# EAGLE schematic Sparkle_and_Shine (EAGLE 9.4.2)
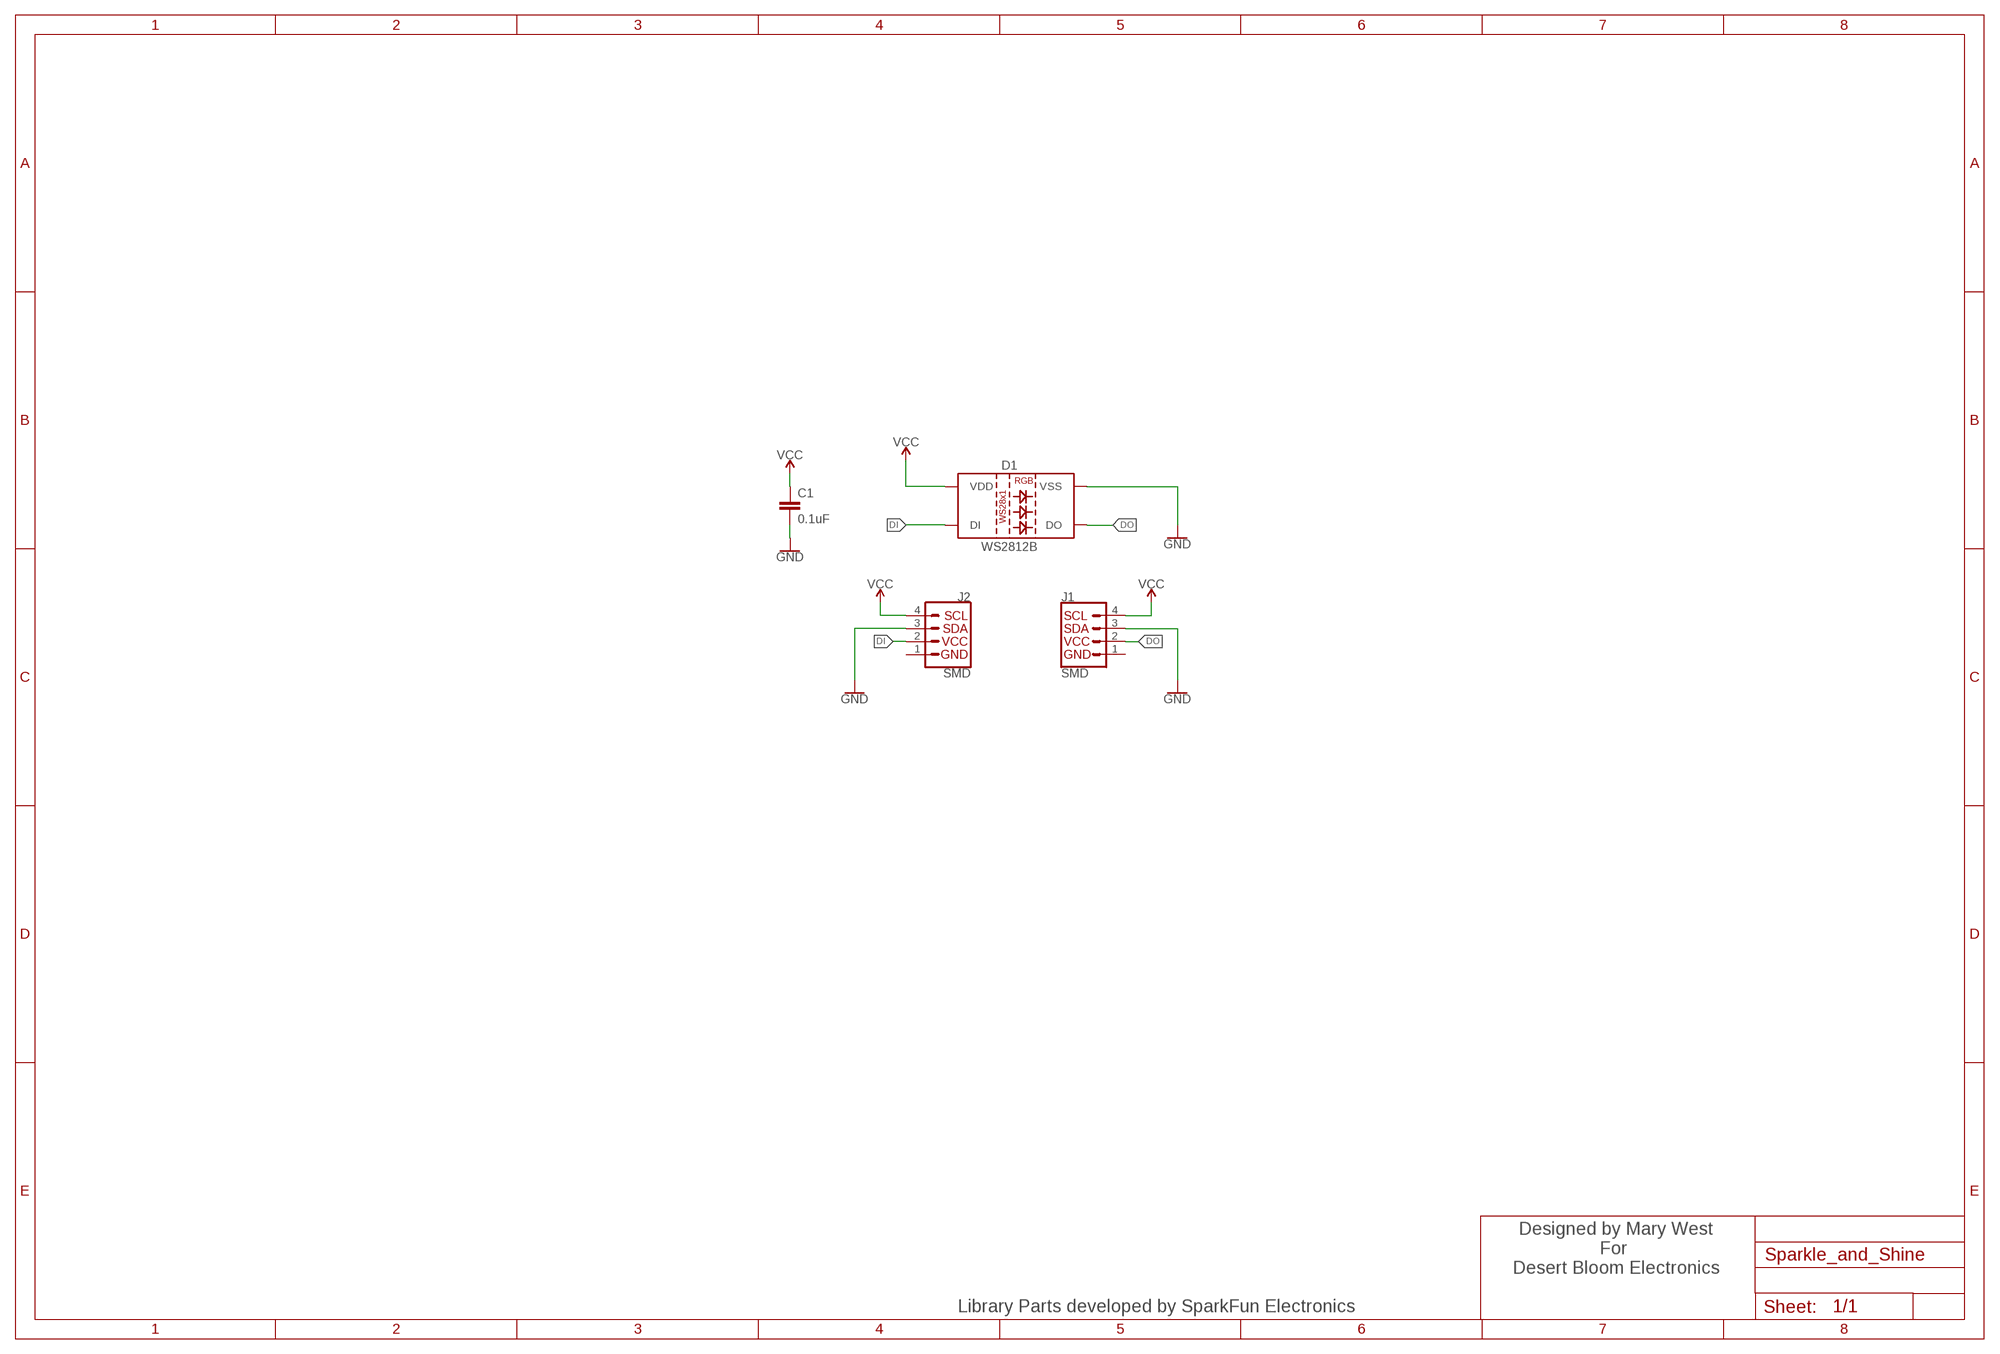
[diagram p0: schematic, sheet 1]

## Parts
C1  0.1uF  0.1UF-0603-25V-(+80/-20%)  [0603]
D1  WS2812B  [WS2812B]
J1  SMD  I2C_STANDARDJS-1MM  [1X04_1MM_RA]
J2  SMD  I2C_STANDARDJS-1MM  [1X04_1MM_RA]

## Nets
DI: D1.4(DI) J2.2(VCC)
DO: D1.2(DO) J1.2(VCC)
GND: C1.2 D1.3(VSS) J1.3(SDA) J2.3(SDA)
VCC: C1.1 D1.1(VDD) J1.4(SCL) J2.4(SCL)

## Notes on the sheet
- Designed by Mary West
  For 
  Desert Bloom Electronics
- Library Parts developed by SparkFun Electronics

## Power pins joined to a net without a drawn wire
GND: J1.1(GND) J2.1(GND)

## Library data of the parts
C1 = SparkFun-Capacitors:0.1UF: 0.1µF ceramic capacitors A capacitor is a passive two-terminal electrical component used to store electrical energy temporarily in an electric field.; PROD_ID: CAP-00810
D1 = SparkFun-LED:WS2812B: WS2812B SMD addressable RGB LED 5x5mm SMD LED with built-in controller IC. Color: Red/Green/Blue mC Rating: RGB: 390, 660, 180 mcd Forward Voltage: RGB: 2.0, 3.0, 3.0 V Packages:WS2812B SparkFun Products: Blynk Board - ESP8266 <https://www.sparkfun.com/products/13794>; PROD_ID: DIO-12503
J1 J2 = SparkX:I2C_STANDARD: SparkFun I2C Standard Pinout Header SparkFun has standardized on a pinout for all I2C based sensor breakouts. This pinout allows I2C boards to be plugged directly into the headers on Arduino Uno compatible boards, and to be daisy chained easily. Example SparkFun Products: SparkFun Atmospheric Sensor Breakout - BME280 <https://www.sparkfun.com/products/13676> SparkFun Altitude/Pressure Sensor Breakout - MPL3115A2 <https://www.sparkfun.com/products/11084> SparkFun TOF Range Finder Sensor - VL6180 <https://www.sparkfun.com/products/12785>